# EAGLE design uv-dosimeter-featherwing-mk-2.2 (EAGLE 7.5.0)
AUTHOR: sean@yak.net
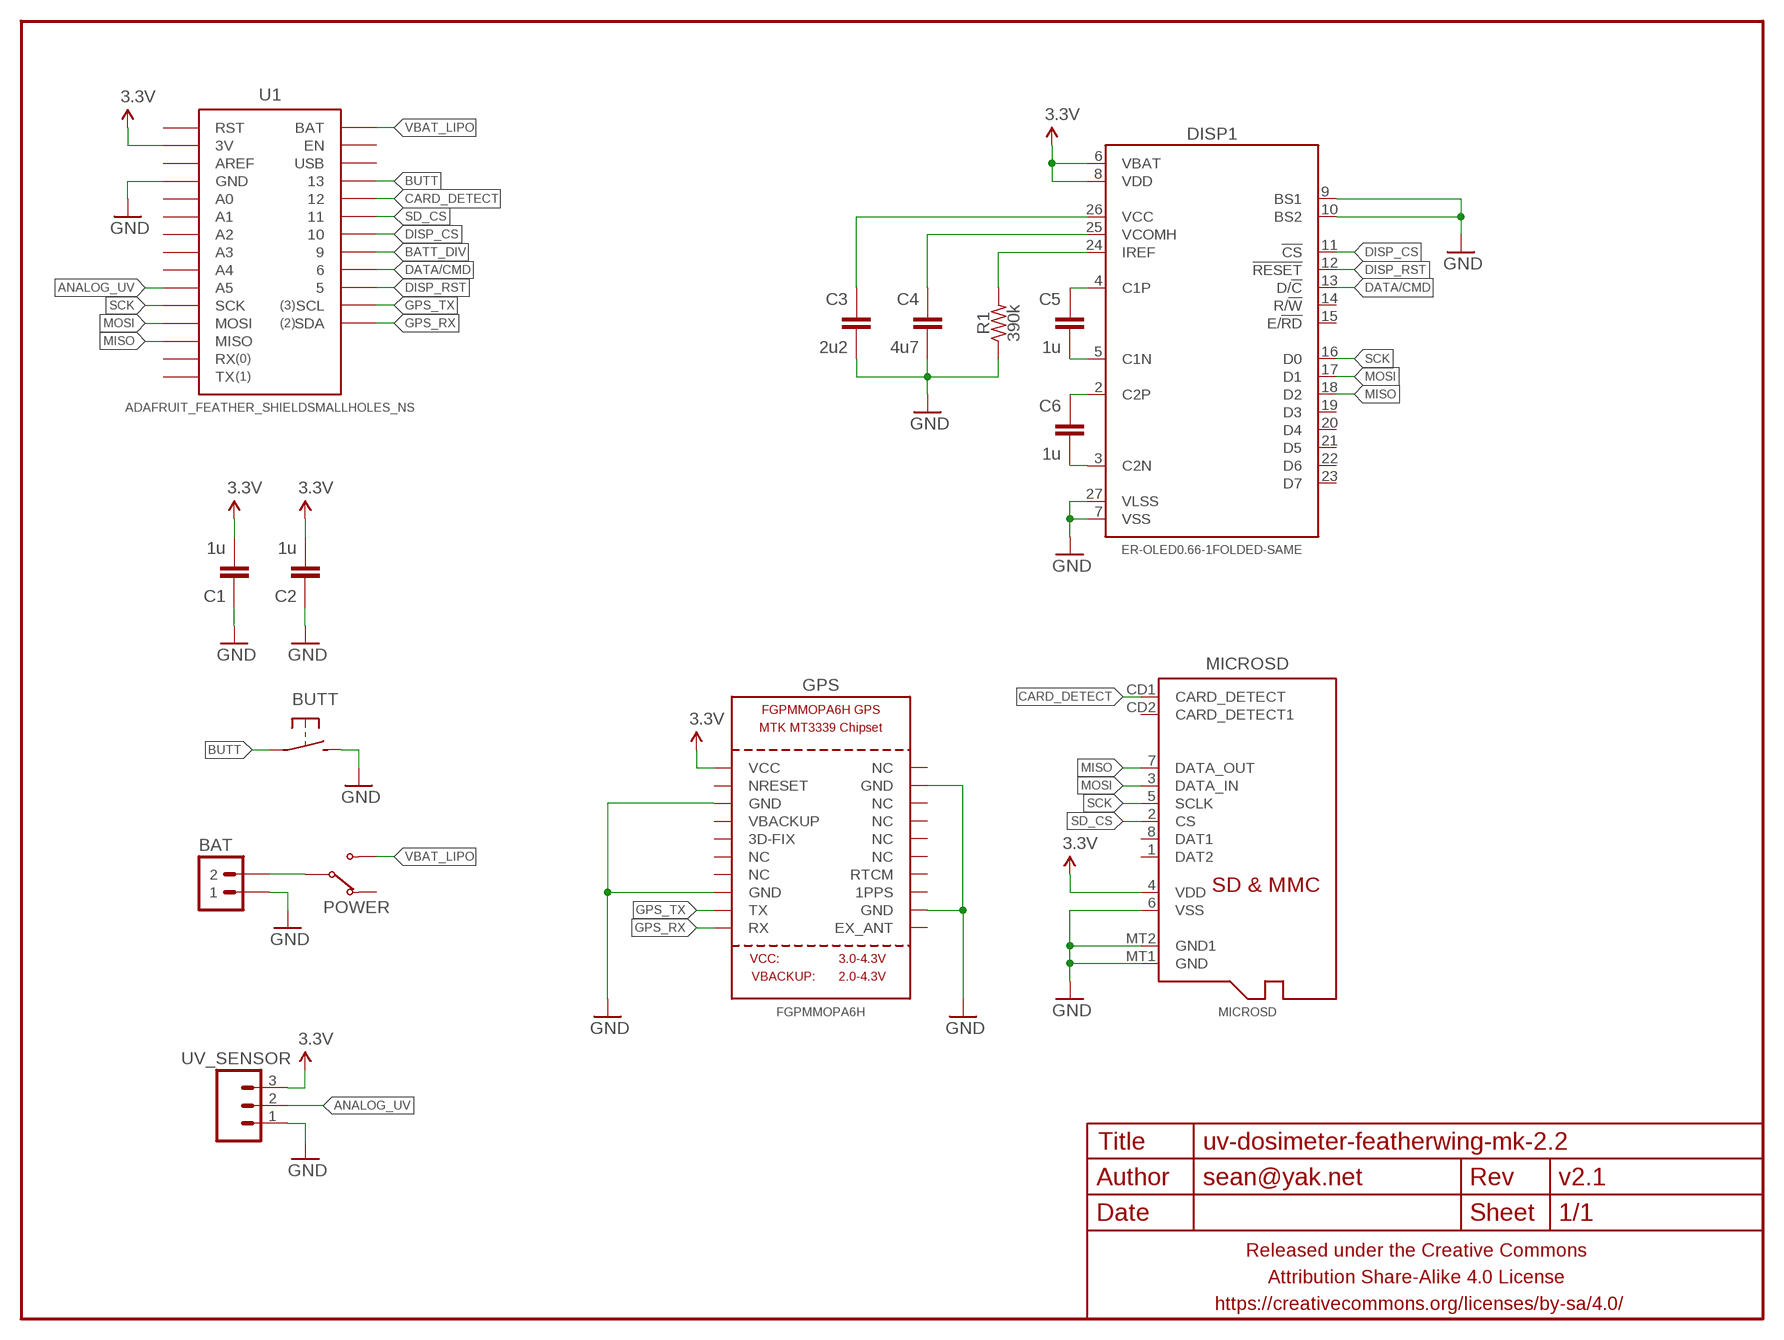
[diagram p0: schematic, sheet 1]

## Parts
BAT  M02JST-2MM-SMT  [JST-2-SMD]
BUTT  SPST-NO-TACT3MM-PTH-SMALL-PADS  [DTS-3-SMALL-PADS]
C1  1u  CAPACITOR-CERAMICC0603  [C0603]
C2  1u  CAPACITOR-CERAMICC0603  [C0603]
C3  2u2  CAPACITOR-CERAMICC0603  [C0603]
C4  4u7  CAPACITOR-CERAMICC0603  [C0603]
C5  1u  CAPACITOR-CERAMICC0603  [C0603]
C6  1u  CAPACITOR-CERAMICC0603  [C0603]
DISP1  ER-OLED0.66-1FOLDED-SAME  [ER-OLED0.66-1-FOLDED-SAME]
FRAME1  FRAME-LETTERNO_PACKAGE  [DUMMY]
GPS  FGPMMOPA6H  GPS_FGPMMOPA6H  [FGPMMOPA6H]
MICROSD  MICROSD  [MICROSD]
POWER  SWITCH-SPDTPTH-VERT-2.54MM  [SWITCH-SPDT]
R1  390k  RESISTORR0603  [R0603]
U1  ADAFRUIT_FEATHER_SHIELDSMALLHOLES_NS  [ADAFRUIT_FEATHER_SMALLHOLES_NS]
UV_SENSOR  M03PTH-CENTERED  [1X03-CENTERED]

## Nets
3.3V: C1.2 C2.2 DISP1.6(VBAT) DISP1.8(VDD) GPS.P$1(VCC) MICROSD.4(VDD) U1.3V UV_SENSOR.3
ANALOG_UV: U1.A5 UV_SENSOR.2
BATT_DIV: U1.9
BUTT: BUTT.1 U1.13
CARD_DETECT: MICROSD.CD1(CARD_DETECT) U1.12
DATA/CMD: DISP1.13(D/!C) U1.6
DISP_CS: DISP1.11(!CS) U1.10
DISP_RST: DISP1.12(!RESET) U1.5
GND: BAT.2 BUTT.2 C1.1 C2.1 C3.2 C4.2 DISP1.7(VSS) DISP1.9(BS1) DISP1.10(BS2) DISP1.27(VLSS) GPS.P$3(GND) GPS.P$8(GND) GPS.P$12(GND) GPS.P$19(GND) MICROSD.6(VSS) MICROSD.MT1(GND) MICROSD.MT2(GND1) R1.1 U1.GND@0(GND) U1.GND@1(GND) UV_SENSOR.1
GPS_RX: GPS.P$10(RX) U1.SDA
GPS_TX: GPS.P$9(TX) U1.SCL
MISO: DISP1.18(D2) MICROSD.7(DATA_OUT) U1.MISO
MOSI: DISP1.17(D1) MICROSD.3(DATA_IN) U1.MOSI
N$1: C5.1 DISP1.4(C1P)
N$2: BAT.1 POWER.2(COM)
N$3: C5.2 DISP1.5(C1N)
N$4: C6.1 DISP1.2(C2P)
N$5: C6.2 DISP1.3(C2N)
N$6: DISP1.24(IREF) R1.2
N$7: C4.1 DISP1.25(VCOMH)
N$8: C3.1 DISP1.26(VCC)
SCK: DISP1.16(D0) MICROSD.5(SCLK) U1.SCK
SD_CS: MICROSD.2(CS) U1.11
VBAT_LIPO: POWER.3(NO) U1.BAT
Unconnected: DISP1.14(R/!W) DISP1.15(E/!RD) DISP1.19(D3) DISP1.20(D4) DISP1.21(D5) DISP1.22(D6) DISP1.23(D7) GPS.P$2(NRESET) GPS.P$4(VBACKUP) GPS.P$5(3D-FIX) GPS.P$6(NC) GPS.P$7(NC) GPS.P$11(EX_ANT) GPS.P$13(1PPS) GPS.P$14(RTCM) GPS.P$15(NC) GPS.P$16(NC) GPS.P$17(NC) GPS.P$18(NC) GPS.P$20(NC) MICROSD.1(DAT2) MICROSD.8(DAT1) MICROSD.CD2(CARD_DETECT1) POWER.1(NC) U1.A0 U1.A1 U1.A2 U1.A3 U1.A4 U1.AREF U1.EN U1.RST U1.RX U1.TX U1.USB

## Library data of the parts
BAT = a_parts:M02: Standard 2-pin 0.1" header. Use with - straight break away headers ( PRT-00116) - right angle break away headers (PRT-00553) - swiss pins (PRT-00743) - machine pins (PRT-00117) - female headers (PRT-00115) Molex polarized connector foot print use with: PRT-08233 with associated crimp pins and housings. 2.54_SCREWTERM for use with PRT-10571. 3.5mm Screw Terminal footprints for PRT-08084 5mm Screw Terminal footprints for use with PRT-08433; PROD_ID: CONN-08352
BUTT = a_parts:SPST-NO-TACT
C1-C6 = a_parts:CAPACITOR-CERAMIC: CAPACITOR, European symbol
DISP1 = a_parts:ER-OLED0.66-1
FRAME1 = A_butts:FRAME-LETTER: Schematic Frame Standard 8.5x11 US Letter frame; DESIGNER: sean@yak.net; VERSION: v2.1
GPS = a_parts:GPS_FGPMMOPA6H: GPS Module - MTK MT3339 Chipset, -165dBm sensitivity, 22 channels, 10Hz, auto-select external antenna options
MICROSD = a_parts:MICROSD: Micro-SD / Transflash card holder with SPI pinout For the 3M # 2908-05WB-MG and/or 4UCON #19656 push-push type
POWER = a_parts:SWITCH-SPDT
R1 = a_parts:RESISTOR: RESISTOR, American symbol
U1 = a_parts:ADAFRUIT_FEATHER_SHIELD
UV_SENSOR = a_parts:M03: Header 3 Standard 3-pin 0.1" header. Use with straight break away headers (SKU : PRT-00116), right angle break away headers (PRT-00553), swiss pins (PRT-00743), machine pins (PRT-00117), and female headers (PRT-00115). Molex polarized connector foot print use with SKU : PRT-08232 with associated crimp pins and housings.

## Board
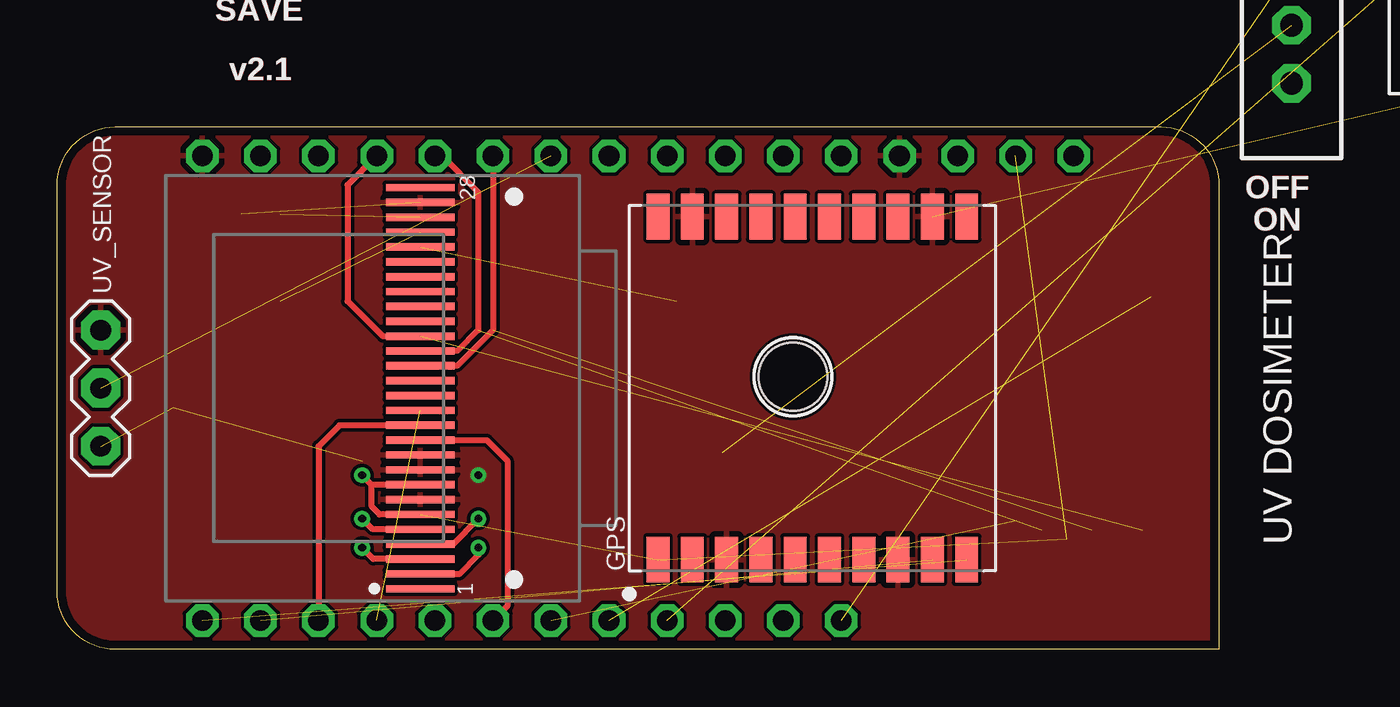
[diagram p1: board, top side]
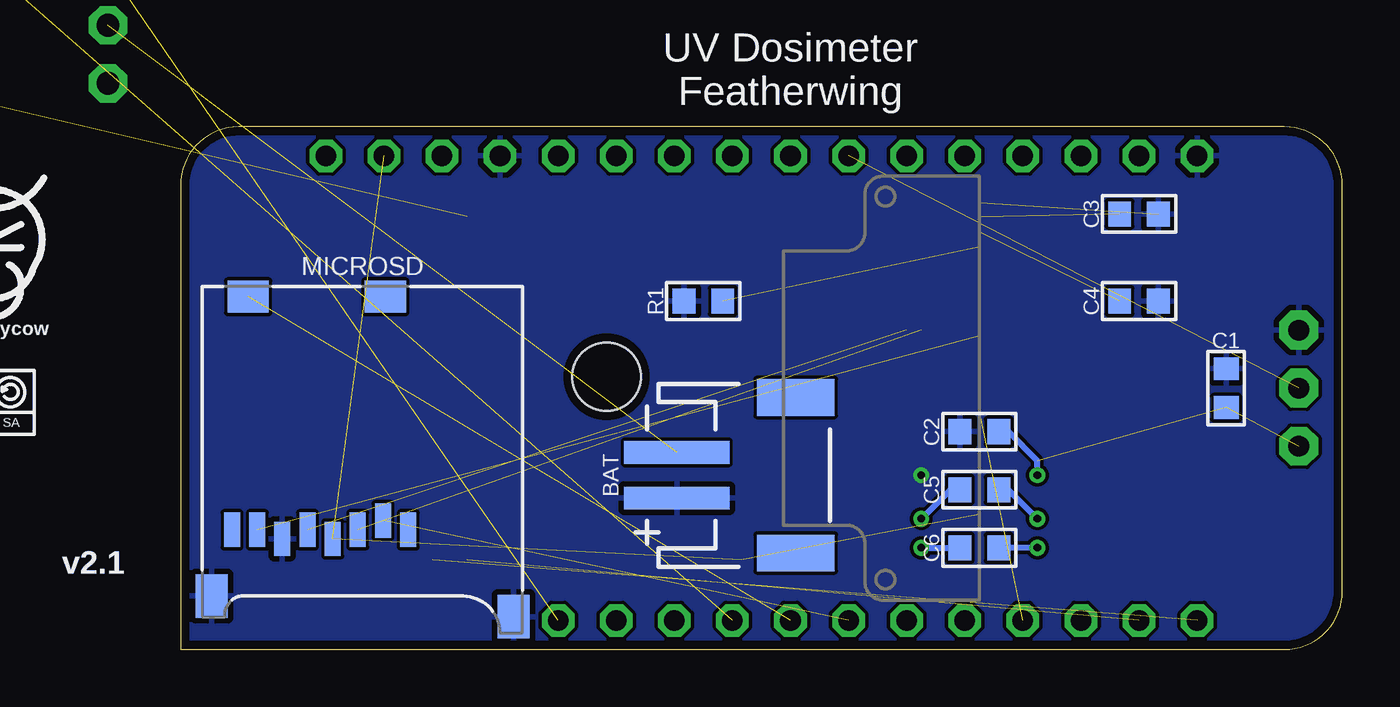
[diagram p2: board, bottom side, seen from below]

Size 50.8 x 22.86 mm. Coordinates in mm from the lower left corner, seen from the top.
Outline: 50.8,20.32 50.8,0 2.54,0 arc-90 0,2.54 0,20.32 arc-90 2.54,22.86 48.26,22.86 arc-90 50.8,20.32
Copper layers (1*16): Top 0.0356mm / dielectric 1.5011mm / Bottom 0.0356mm
Design rules "LaenPCBOrder_2": minimum track width 6mil, minimum drill 13mil, track to track 6mil, track to pad 6mil, pad to pad 6mil, via to via 6mil, smd to smd 6mil, copper to edge 15mil, drill to drill 6mil, minimum pad ring 7mil, minimum via ring 7mil, stop-mask expansion 3mil, vias tented up to drill 20mil, thermal gap 10mil

### Footprints (pad centres in the part's own frame; a part is rotated, then mirrored left to right if it is on the bottom)
JST-2-SMD = smd 1 x 4.6: 1 -1,-3.7; 2 1,-3.7 | smd 1.6 x 3.4: NC1 -3.4,1.5; NC2 3.4,1.5
DTS-3-SMALL-PADS = drill 1.3 pad 2: 1 -3.25,0; 2 3.25,0
C0603 = smd 1 x 1.1: 1 -0.85,0; 2 0.85,0
ER-OLED0.66-1-FOLDED-SAME = smd 0.32 x 3: 1 -8.775,0; 2 -8.125,0; 3 -7.475,0; 4 -6.825,0; 5 -6.175,0; 6 -5.525,0; 7 -4.875,0; 8 -4.225,0; 9 -3.575,0; 10 -2.925,0; 11 -2.275,0; 12 -1.625,0; 13 -0.975,0; 14 -0.325,0; 15 0.325,0; 16 0.975,0; 17 1.625,0; 18 2.275,0; 19 2.925,0; 20 3.575,0; 21 4.225,0; 22 4.875,0; 23 5.525,0; 24 6.175,0; 25 6.825,0; 26 7.475,0; 27 8.125,0; 28 8.775,0
FGPMMOPA6H = smd 2 x 1: P$1 -7.5,6.75; P$2 -7.5,5.25; P$3 -7.5,3.75; P$4 -7.5,2.25; P$5 -7.5,0.75; P$6 -7.5,-0.75; P$7 -7.5,-2.25; P$8 -7.5,-3.75; P$9 -7.5,-5.25; P$10 -7.5,-6.75; P$11 7.5,-6.75; P$12 7.5,-5.25; P$13 7.5,-3.75; P$14 7.5,-2.25; P$15 7.5,-0.75; P$16 7.5,0.75; P$17 7.5,2.25; P$18 7.5,3.75; P$19 7.5,5.25; P$20 7.5,6.75 | hole 3: 0.5,0.85
MICROSD = smd 0.7 x 1.5: 1 9,-10.64; 2 7.9,-10.24; 3 6.8,-10.64; 4 5.7,-11.04; 5 4.6,-10.64; 6 3.5,-11.04; 7 2.4,-10.64; 8 1.3,-10.64 | smd 1.8 x 1.4: CD1 2,-0.44; CD2 8,-0.44 | smd 1.4 x 1.9: MT1 0.4,-13.54; MT2 13.6,-14.44
SWITCH-SPDT = drill 1 pad 1.676 octagon: 1 0,2.54; 2 0,0; 3 0,-2.54
R0603 = smd 1 x 1.1: 1 -0.85,0; 2 0.85,0
ADAFRUIT_FEATHER_SMALLHOLES_NS = drill 0.9 pad 1.422 octagon: 3V -16.51,-10.16; 5 13.97,10.16; 6 11.43,10.16; 9 8.89,10.16; 10 6.35,10.16; 11 3.81,10.16; 12 1.27,10.16; 13 -1.27,10.16; A0 -8.89,-10.16; A1 -6.35,-10.16; A2 -3.81,-10.16; A3 -1.27,-10.16; A4 1.27,-10.16; A5 3.81,-10.16; AREF -13.97,-10.16; BAT -8.89,10.16; EN -6.35,10.16; GND@0 -11.43,-10.16; GND@1 19.05,-10.16; MISO 11.43,-10.16; MOSI 8.89,-10.16; RST -19.05,-10.16; RX 13.97,-10.16; SCK 6.35,-10.16; SCL 16.51,10.16; SDA 19.05,10.16; TX 16.51,-10.16; USB -3.81,10.16
1X03-CENTERED = drill 0.9 pad 1.7 octagon: 1 -2.54,0; 2 0,0; 3 2.54,0

### Placement (x,y rotation side)
BAT  25.4,7.62 270 bottom
BUTT  60.01,27.3 270 top  (outside the outline)
C1  5.08,11.43 270 bottom
C2  15.88,9.53 0 bottom
C3  8.89,19.05 0 bottom
C4  8.89,15.24 0 bottom
C5  15.88,6.99 0 bottom
C6  15.88,4.45 0 bottom
DISP1  15.88,11.43 90 top
FRAME1  0,0 90 bottom
GPS  33.02,11.43 90 top
MICROSD  49.85,15.88 0 bottom
POWER  53.98,27.3 180 top  (outside the outline)
R1  27.94,15.24 0 bottom
U1  25.4,11.43 180 top
U$1  [COW_SMALL]  59.05,18.1 0 bottom  (outside the outline)
U$5  [CC-BY-SA-4.0-NO-URL]  60.01,10.79 0 bottom  (outside the outline)
UV_SENSOR  1.91,11.43 270 top

### Tracks (layer width: path | path; a pad name or v marks a point on that pad's centre or on a via)
3.3V  (via drill 0.33)  (5 unrouted)
  Top 0.254: DISP1.6 14.1,5.91 13.75,6.25 13.75,7.21 | DISP1.8 13.75,7.21 | 13.75,7.21 v13.34,7.62
  Bottom 0.254: v13.34,7.62 13.34,8.26 14.61,9.53 C2.2
ANALOG_UV  (1 unrouted)
BUTT  (1 unrouted)
CARD_DETECT  (1 unrouted)
DATA/CMD  (1 unrouted)
DISP_CS
  Top 0.254: DISP1.11 18.79,9.15 19.68,8.26 19.68,1.91 U1.10
DISP_RST
  Top 0.254: DISP1.12 12.35,9.8 11.43,8.89 U1.5
GND  (via drill 0.33)  (2 unrouted)
  other vias: 18.41,7.62
  pour Top (rank 6): 50.8,20.32 50.8,0 2.54,0 arc-90 0,2.54 0,20.32 arc-90 2.54,22.86 48.26,22.86 arc-90
  pour Bottom (rank 6): 50.8,20.32 50.8,0 2.54,0 arc-90 0,2.54 0,20.32 arc-90 2.54,22.86 48.26,22.86 arc-90
GPS_RX  (1 unrouted)
GPS_TX  (1 unrouted)
MISO  (1 unrouted)
  Top 0.254: U1.MISO 12.7,20.32 12.7,15.24 14.23,13.71 DISP1.18
MOSI  (1 unrouted)
  Top 0.254: U1.MOSI 16.83,21.59 18.41,20 18.41,13.97 17.5,13.05 DISP1.17
N$1  (via drill 0.33)
  Top 0.254: DISP1.4 17.3,4.61 v18.41,5.71
  Bottom 0.254: v18.41,5.71 17.14,6.99 C5.1
N$2  (1 unrouted)
N$3  (via drill 0.33)
  Top 0.254: DISP1.5 13.79,5.25 v13.34,5.71
  Bottom 0.254: v13.34,5.71 14.61,6.99 C5.2
N$4  (via drill 0.33)
  Top 0.254: DISP1.2 17.59,3.31 18.41,4.13 v18.41,4.45
  Bottom 0.254: v18.41,4.45 C6.1
N$5  (via drill 0.33)
  Top 0.254: DISP1.3 13.82,3.96 v13.34,4.45
  Bottom 0.254: v13.34,4.45 C6.2
N$6  (1 unrouted)
N$7  (1 unrouted)
N$8  (1 unrouted)
SCK  (1 unrouted)
  Top 0.254: U1.SCK 19.05,13.97 17.48,12.4 DISP1.16
SD_CS  (1 unrouted)
VBAT_LIPO  (1 unrouted)

### Text on the board
Top: SAVE | OFF | ON
tPlace: SAVE | OFF | ON | UV DOSIMETER
bPlace: UV Dosimeter / Featherwing | by schizobovine / <sean@yak.net>